# Altium schematic sheet DRV8432.SchDoc
size A4; SheetNumber: 1; SheetTotal: 1
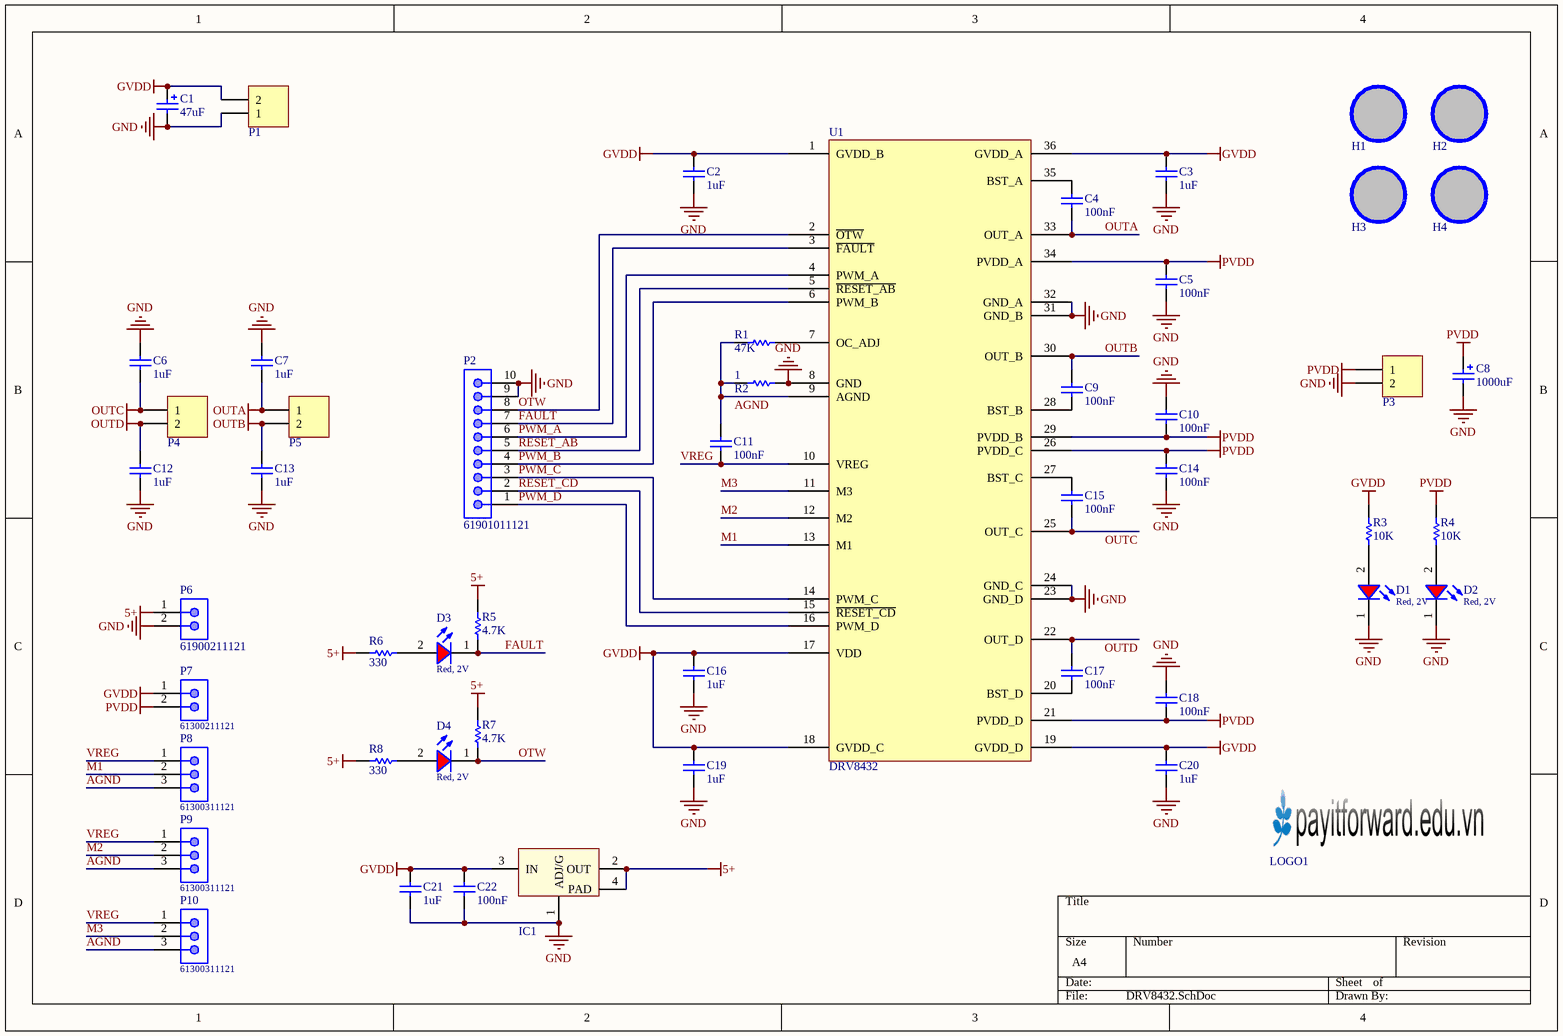
[diagram p0: DRV8432.SchDoc]

## Parts
C1  value 47uF  [CAP ALU SIZE D]  (hidden comment: Cap Pol SMD)
C2  value 1uF  [CAP-SM-0603]  (hidden comment: Cap Non-Pol SMD)
C3  value 1uF  [CAP-SM-0603]  (hidden comment: Cap Non-Pol SMD)
C4  value 100nF  [CAP-SM-0603]  (hidden comment: Cap Non-Pol SMD)
C5  value 100nF  [CAP-SM-0603]  (hidden comment: Cap Non-Pol SMD)
C6  value 1uF  [CAP-SM-0805]  (hidden comment: Cap Non-Pol SMD)
C7  value 1uF  [CAP-SM-0805]  (hidden comment: Cap Non-Pol SMD)
C8  value 1000uF  [CP2/5]  (hidden comment: Cap Pol)
C9  value 100nF  [CAP-SM-0603]  (hidden comment: Cap Non-Pol SMD)
C10  value 100nF  [CAP-SM-0603]  (hidden comment: Cap Non-Pol SMD)
C11  value 100nF  [CAP-SM-0603]  (hidden comment: Cap Non-Pol SMD)
C12  value 1uF  [CAP-SM-0805]  (hidden comment: Cap Non-Pol SMD)
C13  value 1uF  [CAP-SM-0805]  (hidden comment: Cap Non-Pol SMD)
C14  value 100nF  [CAP-SM-0603]  (hidden comment: Cap Non-Pol SMD)
C15  value 100nF  [CAP-SM-0603]  (hidden comment: Cap Non-Pol SMD)
C16  value 1uF  [CAP-SM-0603]  (hidden comment: Cap Non-Pol SMD)
C17  value 100nF  [CAP-SM-0603]  (hidden comment: Cap Non-Pol SMD)
C18  value 100nF  [CAP-SM-0603]  (hidden comment: Cap Non-Pol SMD)
C19  value 1uF  [CAP-SM-0603]  (hidden comment: Cap Non-Pol SMD)
C20  value 1uF  [CAP-SM-0603]  (hidden comment: Cap Non-Pol SMD)
C21  value 1uF  [CAP-SM-0603]  (hidden comment: Cap Non-Pol SMD)
C22  value 100nF  [CAP-SM-0603]  (hidden comment: Cap Non-Pol SMD)
D1  Red, 2V  [WL-SMCW_0603_H=0.7mm]
D2  Red, 2V  [WL-SMCW_0603_H=0.7mm]
D3  Red, 2V  [WL-SMCW_0603_H=0.7mm]
D4  Red, 2V  [WL-SMCW_0603_H=0.7mm]
H1  Hole  [LO KHOAN 3MM]  (value not drawn)
H2  Hole  [LO KHOAN 3MM]  (value not drawn)
H3  Hole  [LO KHOAN 3MM]  (value not drawn)
H4  Hole  [LO KHOAN 3MM]  (value not drawn)
IC1  LM1117  [SOT223-4N]  (value not drawn)
LOGO1  LOGO PIF  [PIF LOGO SMALL TOP]  (value not drawn)
P1  Domino 2  [DOMINO 2- 5mm]  (value not drawn)
P2  61901011121  [61901011121]
P3  Domino 2  [DOMINO 2- 5mm]  (value not drawn)
P4  Domino 2  [DOMINO 2- 5mm]  (value not drawn)
P5  Domino 2  [DOMINO 2- 5mm]  (value not drawn)
P6  61900211121  [61900211121]
P7  61300211121  [61300211121]
P8  61300311121  [61300311121]
P9  61300311121  [61300311121]
P10  61300311121  [61300311121]
R1  value 47K  [RES-SM-0603]  (hidden comment: RESISTOR SMD)
R2  value 1  [RES-SM-0603]  (hidden comment: RESISTOR SMD)
R3  value 10K  [RES-SM-0603]  (hidden comment: RESISTOR SMD)
R4  value 10K  [RES-SM-0603]  (hidden comment: RESISTOR SMD)
R5  value 4.7K  [RES-SM-0603]  (hidden comment: RESISTOR SMD)
R6  value 330  [RES-SM-0603]  (hidden comment: RESISTOR SMD)
R7  value 4.7K  [RES-SM-0603]  (hidden comment: RESISTOR SMD)
R8  value 330  [RES-SM-0603]  (hidden comment: RESISTOR SMD)
U1  DRV8432  [SOP65P1420X360-36N]

## Nets
5+: IC1.2(OUT) IC1.4(PAD) P6.1 R5.2 R6.2 R7.2 R8.2
GND: C1.2 C2.1 C3.1 C5.1 C6.2 C7.2 C8.2 C10.2 C12.1 C13.1 C14.1 C16.1 C18.2 C19.1 C20.1 C21.1 C22.1 D1.1(K) D2.1(K) IC1.1(ADJ/G) P1.1 P2.9 P2.10 P3.2 P6.2 R2.2 U1.8(GND) U1.23(GND_D) U1.24(GND_C) U1.31(GND_B) U1.32(GND_A)
GVDD: C1.1 C2.2 C3.2 C16.2 C19.2 C20.2 C21.2 C22.2 IC1.3(IN) P1.2 P7.1 R3.1 U1.1(GVDD_B) U1.17(VDD) U1.18(GVDD_C) U1.19(GVDD_D) U1.36(GVDD_A)
OUTA: C4.1 C7.1 P5.1 U1.33(OUT_A)
OUTB: C9.2 C13.2 P5.2 U1.30(OUT_B)
OUTC: C6.1 C15.1 P4.1 U1.25(OUT_C)
OUTD: C12.2 C17.2 P4.2 U1.22(OUT_D)
PVDD: C5.2 C8.1 C10.1 C14.2 C18.1 P3.1 P7.2 R4.1 U1.21(PVDD_D) U1.26(PVDD_C) U1.29(PVDD_B) U1.34(PVDD_A)
AGND: C11.2 P8.3 P9.3 P10.3 R1.1 R2.1 U1.9(AGND)
FAULT: D3.1(K) P2.7 R5.1 U1.3(~{FAULT})
M1: P8.2 U1.13(M1)
M2: P9.2 U1.12(M2)
M3: P10.2 U1.11(M3)
OTW: D4.1(K) P2.8 R7.1 U1.2(~{OTW})
PWM_A: P2.6 U1.4(PWM_A)
PWM_B: P2.4 U1.6(PWM_B)
PWM_C: P2.3 U1.14(PWM_C)
PWM_D: P2.1 U1.16(PWM_D)
RESET_AB: P2.5 U1.5(~{RESET_AB})
RESET_CD: P2.2 U1.15(~{RESET_CD})
VREG: C11.1 P8.1 P9.1 P10.1 U1.10(VREG)
NetC4_2: C4.2 U1.35(BST_A)
NetC9_1: C9.1 U1.28(BST_B)
NetC15_2: C15.2 U1.27(BST_C)
NetC17_1: C17.1 U1.20(BST_D)
NetD1_2: D1.2(A) R3.2
NetD2_2: D2.2(A) R4.2
NetD3_2: D3.2(A) R6.1
NetD4_2: D4.2(A) R8.1
NetR1_2: R1.2 U1.7(OC_ADJ)

Not connected (* = marked no-connect by the designer): H1 1; H2 1; H3 1; H4 1

## Library data of the parts
C1 = Cap Pol SMD: Polarized Capacitor (Radial)
C2-C7 C9-C22 = Cap Non-Pol SMD: Capacitor
C8 = Cap Pol: Polarized Capacitor (Radial)
D1-D4 = 150060RS75000: WL-SMCW SMT Mono-color Chip LED Waterclear, size 0603, Red, 2V, 140deg; Chip Technology: AlInGaP; Dominant Wavelength typ.: 625nm; Luminous Intensity typ.: 250mcd; Peak Wavelength typ.: 630nm; Viewing Angle: 140deg; ComponentLink1Description: Manufacturer; ComponentLink1URL: http://www.we-online.de; ComponentLink2URL: https://www.we-online.com/catalog/datasheet/150060RS75000.pdf; ComponentLink2Description: Datasheet; Forward Voltage typ.: 2V; Emitting Color: Red; Mounting Technology: SMT; Operating Temperature: -40 to +85degC; Published Date: December 2019; Part Number: 150060RS75000; Packaging: Tape and Reel; Size: 0603; Publisher: Wurth Elektronik
H1-H4 = Hole: Hole 3mm
IC1 = LM1117: Available in 1.8V, 2.5V, 2.85V, 3.3V, 5V, and  Adjustable Versions; Value: LM317
P1 P3-P5 = Domino 2: Domino, 2-Pin; LatestRevisionDate: 17-Jul-2002; LatestRevisionNote: Re-released for DXP Platform.; Publisher: Altium Limited
P2 = 61901011121: WR-WTB THT Male Vertical Locking Header, pitch 2.54mm, 10p; Pin Number: 10; Contact Resistance: 20mOhm; Rated Current: 3A; Withstanding Voltage: 1000VAC; Working Voltage: 250VAC; ComponentLink1Description: Manufacturer; ComponentLink1URL: http://www.we-online.de; ComponentLink2Description: Datasheet; ComponentLink2URL: https://www.we-online.com/catalog/datasheet/61901011121.pdf; Pitch: 2.54mm; Published Date: January 2020; Publisher: Wurth Elektronik; Mounting Technology: THT; Packaging: Bag; Operating Temperature: -40 to +105degC; Part Number: 61901011121; Gender: Male; Type: Vertical
P6 = 61900211121: WR-WTB THT Male Vertical Locking Header, pitch 2.54mm, 2p; Pin Number: 2; Contact Resistance: 20mOhm; Rated Current: 3A; Withstanding Voltage: 1000VAC; Working Voltage: 250VAC; ComponentLink1Description: Manufacturer; ComponentLink1URL: http://www.we-online.de; ComponentLink2Description: Datasheet; ComponentLink2URL: https://www.we-online.com/catalog/datasheet/61900211121.pdf; Pitch: 2.54mm; Published Date: January 2020; Publisher: Wurth Elektronik; Mounting Technology: THT; Packaging: Bag; Operating Temperature: -40 to +105degC; Part Number: 61900211121; Gender: Male; Type: Vertical
P7 = 61300211121: WR-PHD Pin Header, THT, pitch 2.54mm, Single Row, Vertical, 2p; Manufacturer: Wurth Elektronik; Pin Number: 2; Rated Current: 3A; Working Voltage: 250VAC; Withstanding Voltage: 500VAC; Contact Resistance: 20mOhm; ComponentLink1Description: Manufacturer; ComponentLink1URL: http://www.we-online.de; ComponentLink2Description: Datasheet; ComponentLink2URL: https://www.we-online.com/catalog/datasheet/61300211121.pdf; Manufacturer Part Number: 61300211121; Published Date: May 2020; Pitch: 2.54mm; Operating Temperature: -40 to +105degC; Mounting Technology: THT; Packaging: Bag; Gender: Pin Header; Row Number: Single; Orientation: Vertical
P8-P10 = 61300311121: WR-PHD Pin Header, THT, pitch 2.54mm, Single Row, Vertical, 3p; Manufacturer: Wurth Elektronik; Pin Number: 3; Rated Current: 3A; Working Voltage: 250VAC; Withstanding Voltage: 500VAC; Contact Resistance: 20mOhm; ComponentLink1Description: Manufacturer; ComponentLink1URL: http://www.we-online.de; ComponentLink2Description: Datasheet; ComponentLink2URL: https://www.we-online.com/catalog/datasheet/61300311121.pdf; Manufacturer Part Number: 61300311121; Published Date: May 2020; Pitch: 2.54mm; Operating Temperature: -40 to +105degC; Mounting Technology: THT; Packaging: Bag; Gender: Pin Header; Row Number: Single; Orientation: Vertical
R1-R8 = RESISTOR SMD: Resistor